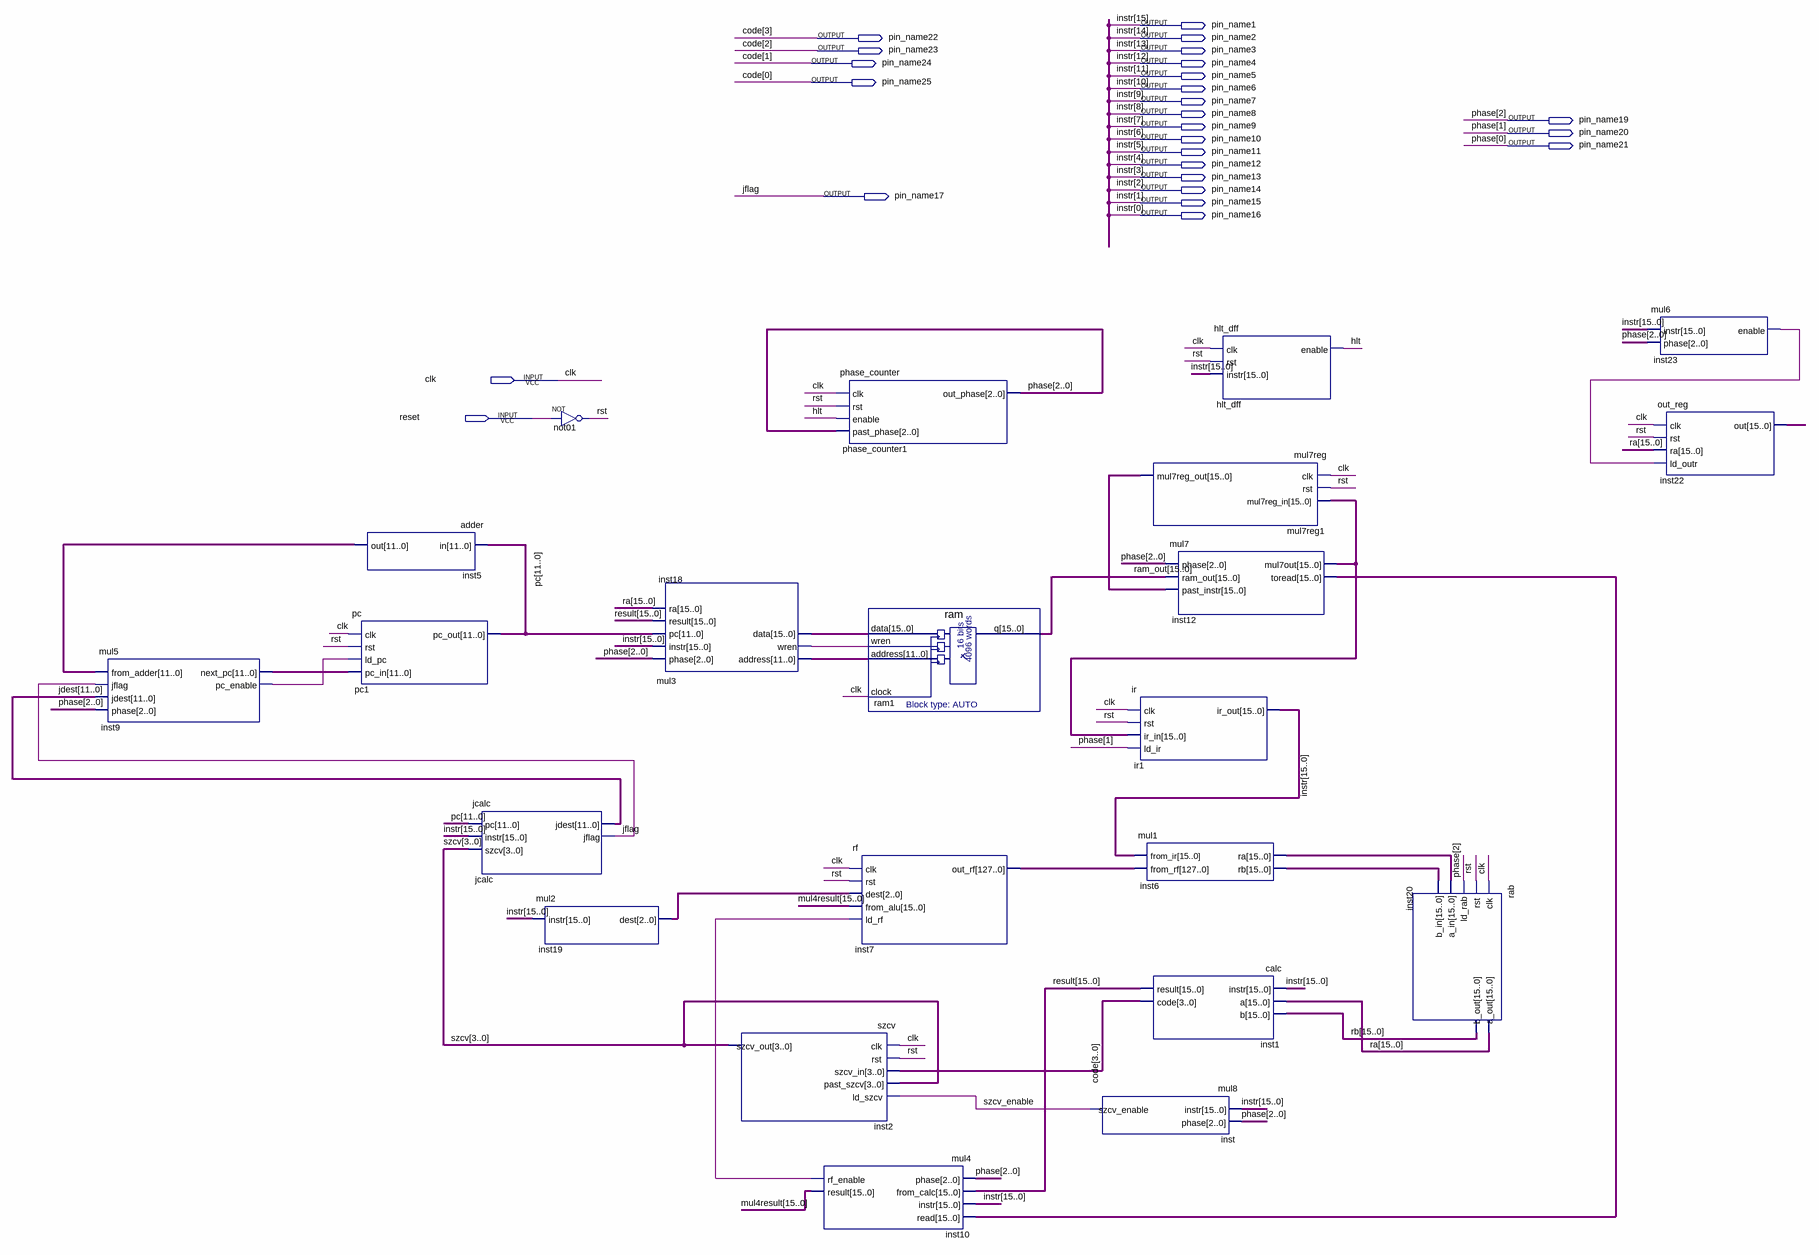
[diagram p0: schematic sheet]
// Quartus schematic SIMPLE_.bdf as structural Verilog: 22 symbols, 26 pins
module SIMPLE_ (
  input  clk,
  input  reset,
  output pin_name1,
  output pin_name22,
  output pin_name2,
  output pin_name23,
  output pin_name3,
  output pin_name24,
  output pin_name4,
  output pin_name5,
  output pin_name25,
  output pin_name6,
  output pin_name7,
  output pin_name8,
  output pin_name19,
  output pin_name9,
  output pin_name20,
  output pin_name10,
  output pin_name21,
  output pin_name11,
  output pin_name12,
  output pin_name13,
  output pin_name14,
  output pin_name17,
  output pin_name15,
  output pin_name16
);

  wire hlt, inst9_pc_enable, inst10_rf_enable, inst18_wren, inst23_enable, rst, szcv_enable;
  wire [2:0] inst19_dest;
  wire [3:0] szcv;
  wire [11:0] inst5_out, inst9_next_pc, inst18_address, jdest, pc;
  wire [15:0] inst6_ra, inst6_rb, inst12_mul7out, inst12_toread, inst18_data, inst22_out, mul4result,
       mul7reg1_mul7reg_out, ra, ram_out, rb, result;
  wire [127:0] inst7_out_rf;

  mul5 inst9 (
    .from_adder(inst5_out), .jflag(pin_name17), .jdest(jdest), .phase({pin_name19, pin_name20, pin_name21}),
    .next_pc(inst9_next_pc), .pc_enable(inst9_pc_enable));
  adder inst5 (.in(pc), .out(inst5_out));
  pc pc1 (.clk(clk), .rst(rst), .ld_pc(inst9_pc_enable), .pc_in(inst9_next_pc), .pc_out(pc));
  jcalc jcalc (
    .pc(pc),
    .instr({pin_name1, pin_name2, pin_name3, pin_name4, pin_name5, pin_name6, pin_name7, pin_name8, pin_name9, pin_name10, pin_name11, pin_name12, pin_name13, pin_name14, pin_name15, pin_name16}),
    .szcv(szcv), .jdest(jdest), .jflag(pin_name17));
  not not01 (rst, reset);
  mul2 inst19 (
    .instr({pin_name1, pin_name2, pin_name3, pin_name4, pin_name5, pin_name6, pin_name7, pin_name8, pin_name9, pin_name10, pin_name11, pin_name12, pin_name13, pin_name14, pin_name15, pin_name16}),
    .dest(inst19_dest));
  mul3 inst18 (
    .phase({pin_name19, pin_name20, pin_name21}),
    .instr({pin_name1, pin_name2, pin_name3, pin_name4, pin_name5, pin_name6, pin_name7, pin_name8, pin_name9, pin_name10, pin_name11, pin_name12, pin_name13, pin_name14, pin_name15, pin_name16}),
    .pc(pc), .result(result), .ra(ra), .address(inst18_address), .wren(inst18_wren), .data(inst18_data));
  szcv inst2 (
    .clk(clk), .rst(rst), .szcv_in({pin_name22, pin_name23, pin_name24, pin_name25}), .past_szcv(szcv),
    .ld_szcv(szcv_enable), .szcv_out(szcv));
  mul4 inst10 (
    .phase({pin_name19, pin_name20, pin_name21}), .from_calc(result),
    .instr({pin_name1, pin_name2, pin_name3, pin_name4, pin_name5, pin_name6, pin_name7, pin_name8, pin_name9, pin_name10, pin_name11, pin_name12, pin_name13, pin_name14, pin_name15, pin_name16}),
    .read(inst12_toread), .rf_enable(inst10_rf_enable), .result(mul4result));
  phase_counter phase_counter1 (
    .clk(clk), .rst(rst), .enable(hlt), .past_phase({pin_name19, pin_name20, pin_name21}),
    .out_phase({pin_name19, pin_name20, pin_name21}));
  ram ram1 (.data(inst18_data), .wren(inst18_wren), .address(inst18_address), .clock(clk), .q(ram_out));
  rf inst7 (
    .clk(clk), .rst(rst), .dest(inst19_dest), .from_alu(mul4result), .ld_rf(inst10_rf_enable),
    .out_rf(inst7_out_rf));
  mul8 inst (
    .instr({pin_name1, pin_name2, pin_name3, pin_name4, pin_name5, pin_name6, pin_name7, pin_name8, pin_name9, pin_name10, pin_name11, pin_name12, pin_name13, pin_name14, pin_name15, pin_name16}),
    .phase({pin_name19, pin_name20, pin_name21}), .szcv_enable(szcv_enable));
  mul7reg mul7reg1 (.clk(clk), .rst(rst), .mul7reg_in(inst12_mul7out), .mul7reg_out(mul7reg1_mul7reg_out));
  mul7 inst12 (
    .phase({pin_name19, pin_name20, pin_name21}), .ram_out(ram_out), .past_instr(mul7reg1_mul7reg_out),
    .mul7out(inst12_mul7out), .toread(inst12_toread));
  ir ir1 (
    .clk(clk), .rst(rst), .ir_in(inst12_mul7out), .ld_ir(pin_name20),
    .ir_out({pin_name1, pin_name2, pin_name3, pin_name4, pin_name5, pin_name6, pin_name7, pin_name8, pin_name9, pin_name10, pin_name11, pin_name12, pin_name13, pin_name14, pin_name15, pin_name16}));
  mul1 inst6 (
    .from_ir({pin_name1, pin_name2, pin_name3, pin_name4, pin_name5, pin_name6, pin_name7, pin_name8, pin_name9, pin_name10, pin_name11, pin_name12, pin_name13, pin_name14, pin_name15, pin_name16}),
    .from_rf(inst7_out_rf), .ra(inst6_ra), .rb(inst6_rb));
  calc inst1 (
    .instr({pin_name1, pin_name2, pin_name3, pin_name4, pin_name5, pin_name6, pin_name7, pin_name8, pin_name9, pin_name10, pin_name11, pin_name12, pin_name13, pin_name14, pin_name15, pin_name16}),
    .a(ra), .b(rb), .result(result), .code({pin_name22, pin_name23, pin_name24, pin_name25}));
  hlt_dff hlt_dff (
    .clk(clk), .rst(rst),
    .instr({pin_name1, pin_name2, pin_name3, pin_name4, pin_name5, pin_name6, pin_name7, pin_name8, pin_name9, pin_name10, pin_name11, pin_name12, pin_name13, pin_name14, pin_name15, pin_name16}),
    .enable(hlt));
  rab inst20 (.clk(clk), .rst(rst), .ld_rab(pin_name19), .a_in(inst6_ra), .b_in(inst6_rb), .a_out(ra), .b_out(rb));
  mul6 inst23 (
    .instr({pin_name1, pin_name2, pin_name3, pin_name4, pin_name5, pin_name6, pin_name7, pin_name8, pin_name9, pin_name10, pin_name11, pin_name12, pin_name13, pin_name14, pin_name15, pin_name16}),
    .phase({pin_name19, pin_name20, pin_name21}), .enable(inst23_enable));
  out_reg inst22 (.clk(clk), .rst(rst), .ra(ra), .ld_outr(inst23_enable), .out(inst22_out));

  // Other names for the same wires on the sheet: code[3:0] = {pin_name22, pin_name23, pin_name24, pin_name25};
  //   instr[15:0] = {pin_name1, pin_name2, pin_name3, pin_name4, pin_name5, pin_name6, pin_name7, pin_name8, pin_name9, pin_name10, pin_name11, pin_name12, pin_name13, pin_name14, pin_name15, pin_name16};
  //   jflag = pin_name17; phase[2:0] = {pin_name19, pin_name20, pin_name21}
endmodule
